# Altium schematic sheet top level.SchDoc
size A4
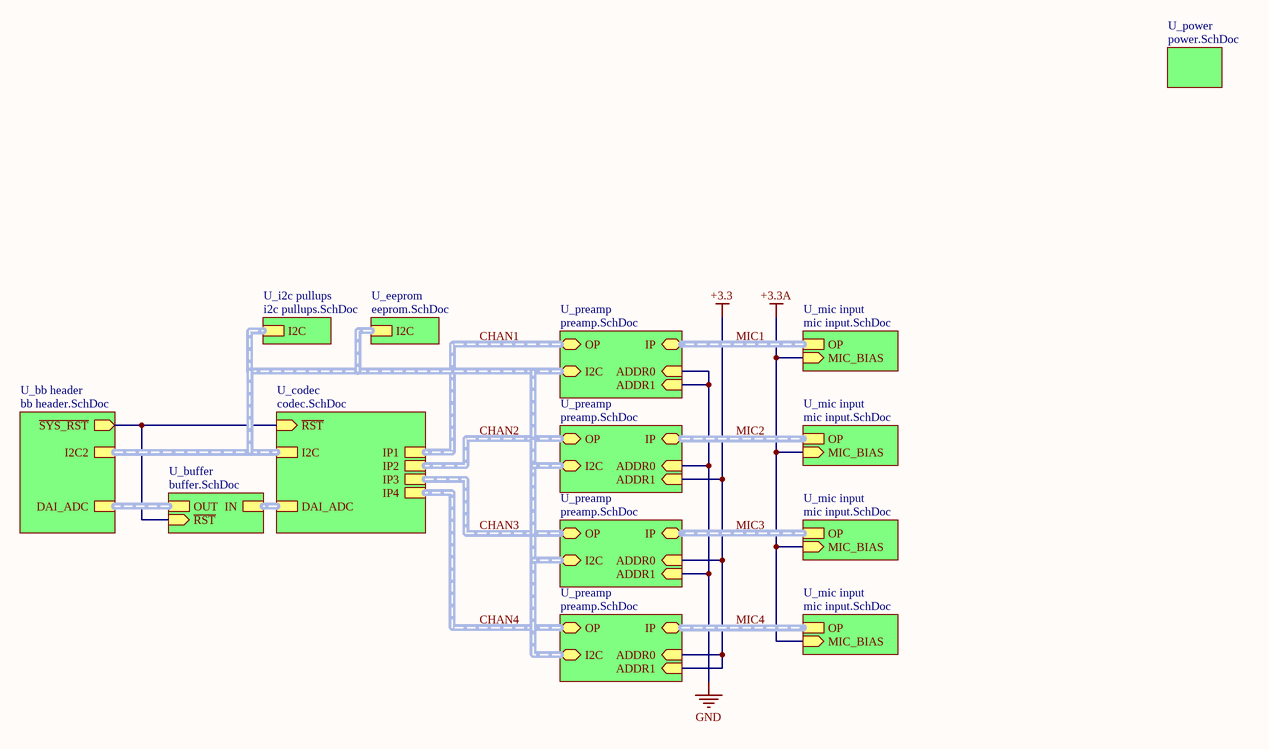
[diagram p0: top level.SchDoc]

## Sub-sheets
U_bb header = bb header.SchDoc: ~{SYS_RST} (out), I2C2 (harness I2C), DAI_ADC (harness DAI_4CH)
U_buffer = buffer.SchDoc: IN (harness DAI_4CH), OUT (harness DAI_4CH), ~{RST} (in)
U_codec = codec.SchDoc: I2C (harness I2C), ~{RST} (in), DAI_ADC (harness DAI_4CH), IP1 (harness ANALOG_DIFF), IP2 (harness ANALOG_DIFF), IP3 (harness ANALOG_DIFF), IP4 (harness ANALOG_DIFF)
U_eeprom = eeprom.SchDoc: I2C (harness I2C)
U_i2c pullups = i2c pullups.SchDoc: I2C (harness I2C)
U_mic input = mic input.SchDoc: MIC_BIAS (in), OP (harness ANALOG_DIFF)
U_mic input = mic input.SchDoc: MIC_BIAS (in), OP (harness ANALOG_DIFF)
U_mic input = mic input.SchDoc: MIC_BIAS (in), OP (harness ANALOG_DIFF)
U_mic input = mic input.SchDoc: MIC_BIAS (in), OP (harness ANALOG_DIFF)
U_power = power.SchDoc: no entries
U_preamp = preamp.SchDoc: IP (harness ANALOG_DIFF), OP (harness ANALOG_DIFF), I2C (harness I2C), ADDR0 (in), ADDR1 (in)
U_preamp = preamp.SchDoc: IP (harness ANALOG_DIFF), OP (harness ANALOG_DIFF), I2C (harness I2C), ADDR0 (in), ADDR1 (in)
U_preamp = preamp.SchDoc: IP (harness ANALOG_DIFF), OP (harness ANALOG_DIFF), I2C (harness I2C), ADDR0 (in), ADDR1 (in)
U_preamp = preamp.SchDoc: IP (harness ANALOG_DIFF), OP (harness ANALOG_DIFF), I2C (harness I2C), ADDR0 (in), ADDR1 (in)

## Nets
+3.3: sheet U_preamp/ADDR1, sheet U_preamp/ADDR0, sheet U_preamp/ADDR0, sheet U_preamp/ADDR1
+3.3A: sheet U_mic input/MIC_BIAS, sheet U_mic input/MIC_BIAS, sheet U_mic input/MIC_BIAS, sheet U_mic input/MIC_BIAS
GND: sheet U_preamp/ADDR0, sheet U_preamp/ADDR1, sheet U_preamp/ADDR0, sheet U_preamp/ADDR1
(unnamed): sheet U_codec/~{RST}, sheet U_bb header/~{SYS_RST}, sheet U_buffer/~{RST}

## Buses and harness runs
harness CHAN1 = sheet U_codec/IP1 = sheet U_preamp/OP
harness CHAN2 = sheet U_codec/IP2 = sheet U_preamp/OP
harness CHAN3 = sheet U_codec/IP3 = sheet U_preamp/OP
harness CHAN4 = sheet U_codec/IP4 = sheet U_preamp/OP
harness MIC1 = sheet U_mic input/OP = sheet U_preamp/IP
harness MIC2 = sheet U_mic input/OP = sheet U_preamp/IP
harness MIC3 = sheet U_mic input/OP = sheet U_preamp/IP
harness MIC4 = sheet U_mic input/OP = sheet U_preamp/IP
harness sheet U_bb header/DAI_ADC = sheet U_buffer/OUT
harness sheet U_bb header/I2C2 = sheet U_codec/I2C = sheet U_eeprom/I2C = sheet U_i2c pullups/I2C = sheet U_preamp/I2C
harness sheet U_buffer/IN = sheet U_codec/DAI_ADC